# EAGLE design USBBoost (EAGLE 6.3)
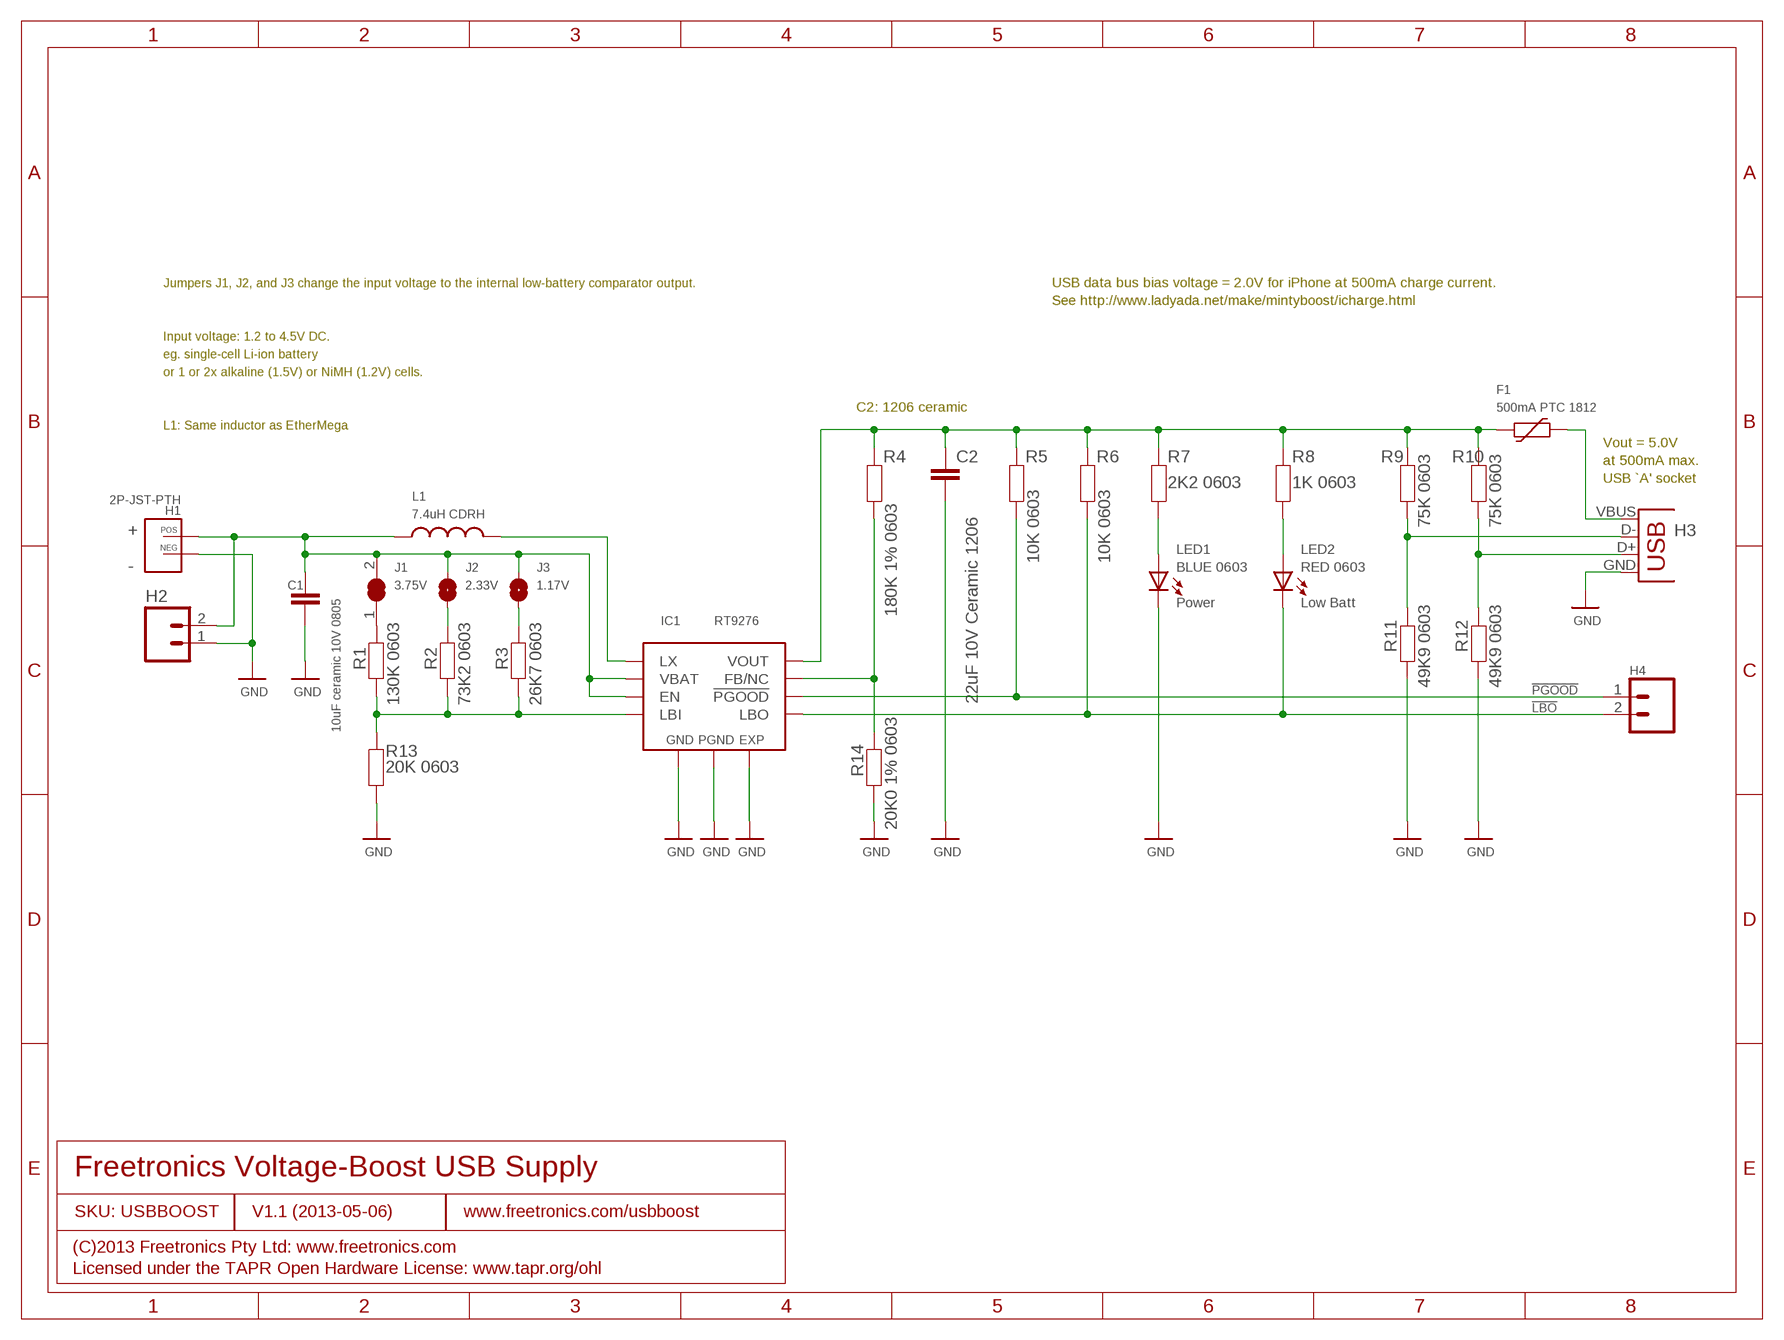
[diagram p0: schematic, sheet 1]

## Parts
C1  10uF ceramic 10V 0805  C-EUC0805  [C0805]
C2  22uF 10V Ceramic 1206  C-EUC1206K  [C1206K]
F1  500mA PTC 1812  PTC  [1812]
H1  2P-JST-PTH  2P-JST-TH-RAPTH  [JST-2MM-TH-RA]
H2  M02PTH  [1X02]
H3  USB  USB_  [USB-A-S-SILK-FEMALE]
H4  Status  M02PTH  [1X02]
IC1  RT9276  [WDFN-10L-3X3]
J1  3.75V  SJCN  [SJC]
J2  2.33V  SJ  [SJ]
J3  1.17V  SJ  [SJ]
L1  7.4uH CDRH  INDUCTOR  [CDRH]
LED1  BLUE 0603  LED0603  [LED-0603]
LED2  RED 0603  LED0603  [LED-0603]
R1  130K 0603  RESISTOR0603  [0603]
R2  73K2 0603  RESISTOR0603  [0603]
R3  26K7 0603  RESISTOR0603  [0603]
R4  180K 1% 0603  RESISTOR0603  [0603]
R5  10K 0603  RESISTOR0603  [0603]
R6  10K 0603  RESISTOR0603  [0603]
R7  2K2 0603  RESISTOR0603  [0603]
R8  1K 0603  RESISTOR0603  [0603]
R9  75K 0603  RESISTOR0603  [0603]
R10  75K 0603  RESISTOR0603  [0603]
R11  49K9 0603  RESISTOR0603  [0603]
R12  49K9 0603  RESISTOR0603  [0603]
R13  20K 0603  RESISTOR0603  [0603]
R14  20K0 1% 0603  RESISTOR0603  [0603]

## Nets
!LBO: H4.2 IC1.4(LBO) LED2.C R6.2
!PGOOD: H4.1 IC1.8(!PGOOD) R5.2
FB: IC1.3(FB/NC) R4.2 R14.2
GND: C1.2 C2.2 H1.NEG H2.1 H3.GND IC1.5(GND) IC1.10(PGND) IC1.EXP LED1.C R11.2 R12.2 R13.1 R14.1
LBI: IC1.7(LBI) R1.1 R2.1 R3.1 R13.2
LX: IC1.9(LX) L1.2
N$5: J1.1 R1.2
N$7: H3.D- R9.2 R11.1
N$8: LED1.A R7.2
N$9: F1.2 H3.VBUS
N$10: H3.D+ R10.2 R12.1
N$11: J2.1 R2.2
N$12: J3.1 R3.2
N$15: LED2.A R8.2
VBAT: C1.1 H1.POS H2.2 IC1.1(EN) IC1.6(VBAT) J1.2 J2.2 J3.2 L1.1
VOUT: C2.1 F1.1 IC1.2(VOUT) R4.1 R5.1 R6.1 R7.1 R8.1 R9.1 R10.1

## Notes on the sheet
- Jumpers J1, J2, and J3 change the input voltage to the internal low-battery comparator output. | USB data bus bias voltage = 2.0V for iPhone at 500mA charge current.
- See http://www.ladyada.net/make/mintyboost/icharge.html
- Input voltage: 1.2 to 4.5V DC.
- eg. single-cell Li-ion battery
- or 1 or 2x alkaline (1.5V) or NiMH (1.2V) cells.
- C2: 1206 ceramic
- L1: Same inductor as EtherMega
- Vout = 5.0V
- at 500mA max.
- USB `A' socket
- + | H3
- -
- Power | Low Batt
- Freetronics Voltage-Boost USB Supply
- SKU: USBBOOST | V1.1 (2013-05-06) | www.freetronics.com/usbboost
- (C)2013 Freetronics Pty Ltd: www.freetronics.com
- Licensed under the TAPR Open Hardware License: www.tapr.org/ohl

## Library data of the parts
C1 C2 = freetronics-jon:C-EU: CAPACITOR, European symbol
F1 = freetronics-luke:PTC: Polymeric PTC ("Polyfuse")
H1 = freetronics-jon:2P-JST-TH-RA: 2.0 mm pitch, through-hole 2-pin right-angle JST header, suitable for small Li-po batteries.
H2 = freetronics-master-v1.1:M02: Header 2 Standard 2-pin 0.1" header. Use with straight break away headers (SKU : PRT-00116), right angle break away headers (PRT-00553), swiss pins (PRT-00743), machine pins (PRT-00117), and female headers (PRT-00115). Molex polarized connector foot print use with SKU : PRT-08233 with associated crimp pins and housings.
H3 = freetronics-master-v1:USB: USB Connectors USB-B-PTH is fully proven SKU : PRT-00139 USB-miniB is fully proven SKU : PRT-00587 USB-A-PCB is untested. USB-A-H is throughly reviewed, but untested. Spark Fun Electronics SKU : PRT-00437 USB-B-SMT is throughly reviewed, but untested. Needs silkscreen touching up. USB-A-S has not been used/tested USB-MB-H has not been used/tested
H4 = freetronics-master-v1:M02: Header 2 Standard 2-pin 0.1" header. Use with straight break away headers (SKU : PRT-00116), right angle break away headers (PRT-00553), swiss pins (PRT-00743), machine pins (PRT-00117), and female headers (PRT-00115). Molex polarized connector foot print use with SKU : PRT-08233 with associated crimp pins and housings.
IC1 = freetronics-luke:RT9276: Richtek RT9276 boost converter. www.richtek.com/download_ds.jsp?s=631
J1 = freetronics-jon:SJC
J2 J3 = freetronics-luke:SJ: PCB "solder jumper". Note that there should nothing on the BOM corresponding to this "component".
L1 = freetronics-luke:INDUCTOR
LED1 LED2 = freetronics-master-v1:LED: LEDs Standard schematic elements and footprints for 5mm, 3mm, 1206, and 0603 sized LEDs. 5mm - Spark Fun Electronics SKU : COM-00529 (and others)
R1 = freetronics-master-v1.1:RESISTOR: Resistor Basic schematic elements and footprints for 0603, 1206, and PTH 1/10th watt (small) resistors.
R2-R14 = freetronics-original:RESISTOR: Resistor Basic schematic elements and footprints for 0603, 1206, and PTH 1/10th watt (small) resistors.

## Net classes
0 default: width 0.152 mm, drill 0.241 mm, clearance 0.152 mm

## Board
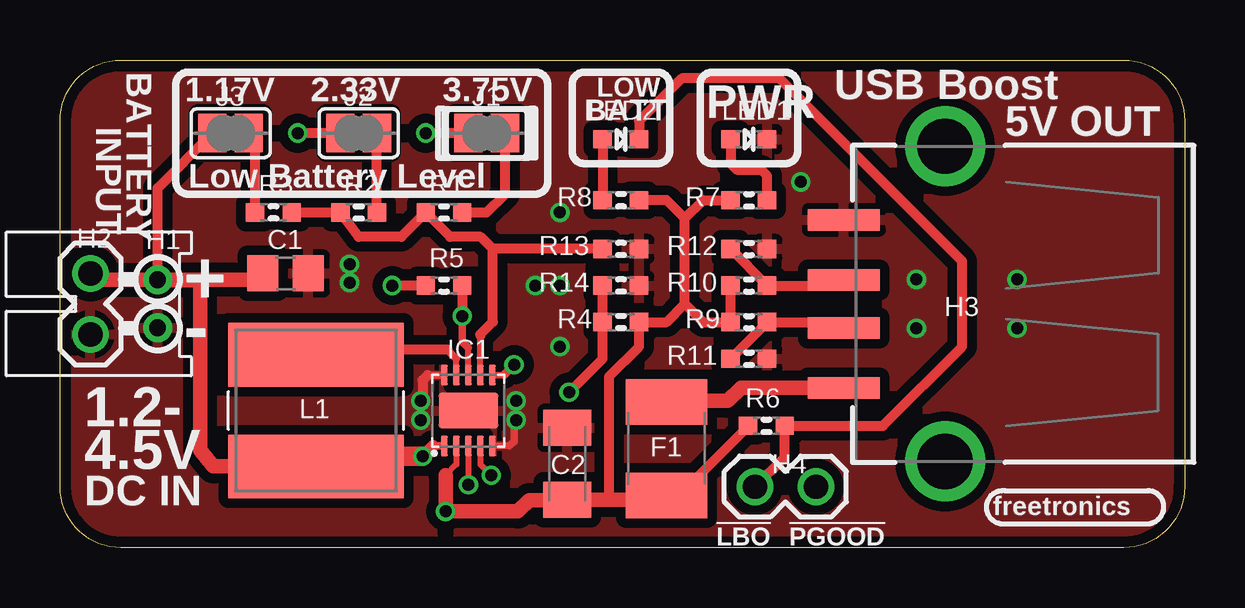
[diagram p1: board, top side]
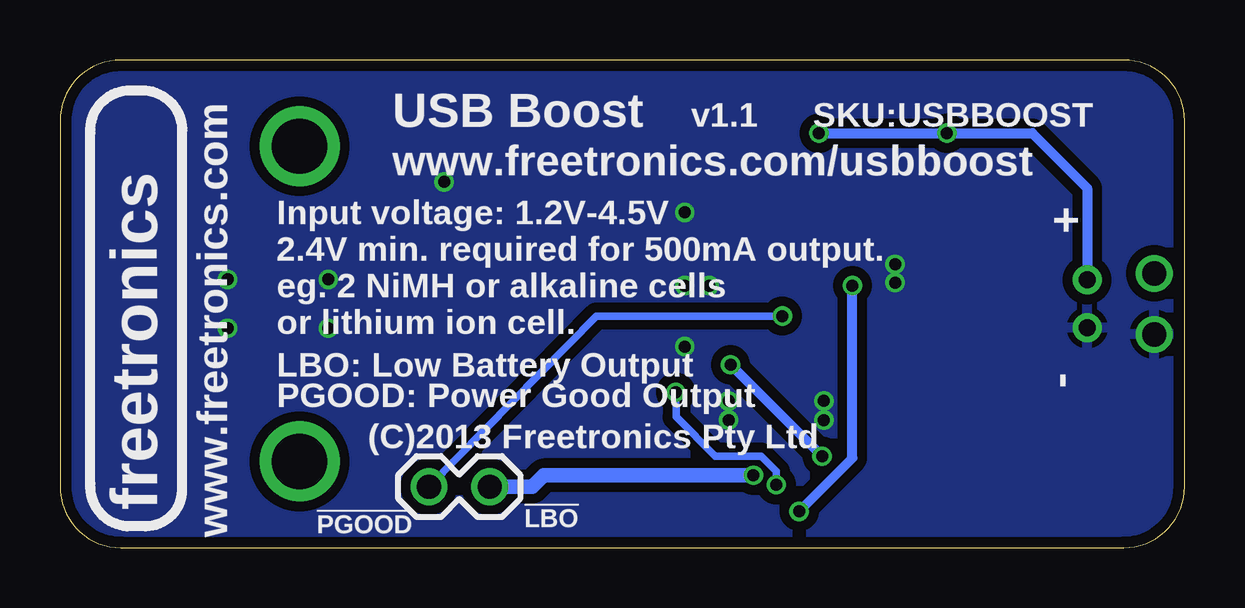
[diagram p2: board, bottom side, seen from below]

Size 46.86 x 20.32 mm. Coordinates in mm from the lower left corner, seen from the top.
Outline: 0,17.78 arc-90 2.54,20.32 44.32,20.32 arc-90 46.86,17.78 46.86,2.54 arc-90 44.32,0 2.54,0 arc-90 0,2.54 0,17.78
Copper layers (1*16): Top 0.035mm / dielectric 1.5mm / Bottom 0.035mm
Design rules "default": minimum track width 8mil, minimum drill 15mil, track to track 8mil, track to pad 8mil, pad to pad 8mil, via to via 8mil, smd to smd 8mil, copper to edge 18mil, drill to drill 8mil, minimum pad ring 10mil, minimum via ring 6mil, stop-mask expansion 4mil, vias tented up to drill 25mil, thermal gap 10mil

### Footprints (pad centres in the part's own frame; a part is rotated, then mirrored left to right if it is on the bottom)
C0805 = smd 1.3 x 1.5: 1 -0.95,0; 2 0.95,0
C1206K = smd 1.5 x 2: 1 -1.5,0; 2 1.5,0
1812 = smd 1.9 x 3.4: 1 -1.95,0; 2 1.95,0
JST-2MM-TH-RA = drill 0.7: NEG -1,-3.81; POS 1,-3.81
1X02 = drill 1.016: 1 0,0; 2 2.54,0
USB-A-S-SILK-FEMALE = smd 3 x 0.9: D+ 7.212,-1; D- 7.212,1; GND 7.212,-3.5; VBUS 7.212,3.5 | drill 2.311: SHELL1 3,6.566; SHELL2 3,-6.566
WDFN-10L-3X3 = smd 0.85 x 0.3: 1 -1.475,1; 2 -1.475,0.5; 3 -1.475,0; 4 -1.475,-0.5; 5 -1.475,-1; 6 1.475,-1; 7 1.475,-0.5; 8 1.475,0; 9 1.475,0.5; 10 1.475,1 | smd 1.5 x 2.5: EXP 0,0
SJC = smd 1.168 x 1.6: 1 -0.762,0; 2 0.762,0
SJ = smd 1.168 x 1.6: 1 -0.762,0; 2 0.762,0
CDRH = smd 7.3 x 2.65: 1 0,2.325; 2 0,-2.325
LED-0603 = smd 0.762 x 0.762: A -0.762,0; C 0.762,0
0603 = smd 0.762 x 0.762: 1 -0.762,0; 2 0.762,0

### Placement (x,y rotation side)
C1  9.4,11.43 0 top
C2  21.15,3.49 90 top
F1  25.27,4.13 90 top
H1  0.25,10.16 90 top
H2  1.27,8.89 90 top
H3  39.88,10.16 180 top
H4  31.5,2.54 180 top
IC1  17.02,5.71 90 top
J1  17.78,17.27 180 top
J2  12.45,17.27 180 top
J3  7.11,17.27 180 top
L1  10.67,5.71 180 top
LED1  28.7,17.02 0 top
LED2  23.37,17.02 0 top
R1  16,13.97 0 top
R2  12.45,13.97 0 top
R3  8.89,13.97 180 top
R4  23.37,9.4 180 top
R5  16,10.92 0 top
R6  29.43,5.08 0 top
R7  28.7,14.48 0 top
R8  23.37,14.48 180 top
R9  28.7,9.4 0 top
R10  28.7,10.92 0 top
R11  28.7,7.87 0 top
R12  28.7,12.45 0 top
R13  23.37,12.45 180 top
R14  23.37,10.92 180 top

### Tracks (layer width: path | path; a pad name or v marks a point on that pad's centre or on a via)
!LBO  (via drill 0.5)
  Top 0.254: IC1.4 17.52,3.47 v17.97,3.02
  Top 0.406: LED2.C 24.13,17.78 25.91,19.56 29.97,19.56 37.59,11.94 37.59,8.38 34.29,5.08 R6.2 30.19,3.78 H4.2
  Bottom 0.61: v17.97,3.02 26.7,3.02 27.18,2.54 H4.2
!PGOOD  (via drill 0.5)
  Top 0.254: IC1.8 17.02,8.33
  Top 0.305: 17.02,8.33 16.76,8.59 v16.76,9.65
  Top 0.406: R5.2 v16.76,9.65
  Bottom 0.305: H4.1 24.51,9.65 v16.76,9.65
FB  (via drill 0.5)
  Top 0.254: IC1.3 v17.02,2.62
  Top 0.406: R14.2 R4.2 22.61,7.87 v21.21,6.48
  Bottom 0.305: v17.02,2.62 17.02,3.17 17.65,3.81 19.56,3.81 21.19,5.45 v21.21,6.48
GND  (via drill 0.5)
  Top 0.279: IC1.5 18.72,4.24
  Top 0.305: IC1.10 15.32,7.19 | 18.72,4.24 18.92,4.45 18.92,5.24 v19,5.32
  Top 0.406: 15.32,7.19 15.11,6.99 15.11,6.19 v15.03,6.11
  other vias: 19,6.11 15.03,5.32 20.83,10.92 30.86,15.24 35.69,11.18 35.69,9.14 39.88,11.18 12.06,11.81 12.06,11.05 20.83,13.97 19.81,10.92 20.83,8.38 39.88,9.14
  pour Top (isolate 0.406): 0,17.78 arc-90 2.54,20.32 44.32,20.32 arc-90 46.86,17.78 46.86,2.54 arc-90 44.32,0 2.54,0 arc-90 0,2.54
  pour Bottom (isolate 0.406): 0,17.78 arc-90 2.54,20.32 44.32,20.32 arc-90 46.86,17.78 46.86,2.54 arc-90 44.32,0 2.54,0 arc-90 0,2.54
LBI
  Top 0.254: IC1.7 17.52,8.85
  Top 0.406: R3.1 R2.1 12.45,12.95 14.22,12.95 R1.1 16.26,12.95 17.53,12.95 18.03,12.45 | 18.03,12.45 18.03,9.41 17.52,8.9 17.52,8.85 | R13.2 18.03,12.45
LX
  Top 0.254: IC1.9 16.52,7.88 | 13.21,8.26 13.13,8.18
  Top 0.305: 16.52,7.88 16.14,8.26
  Top 0.406: 16.14,8.26 13.21,8.26 | 13.13,8.18 10.11,8.18 10.03,8.26 10.45,8.26 L1.2
N$5
  Top 0.406: R1.2 17.78,13.97 18.54,14.73 J1.1
N$7
  Top 0.406: 32.55,9.27 H3.D- 32.43,9.4 R9.2 R11.1
N$8
  Top 0.406: R7.2 29.46,15.49 29.21,15.75 28.19,15.75 27.94,16 LED1.A
N$9
  Top 0.61: 31.62,6.66 28.38,6.66 27.83,6.11 25.31,6.11 F1.2
  Top 0.813: H3.VBUS 31.62,6.66 | 25.32,6.03 F1.2
N$10
  Top 0.406: H3.D+ 32.43,10.92 R10.2 R12.1
N$11
  Top 0.406: R2.2 J2.1
N$12
  Top 0.406: R3.2 8.13,17.02 J3.1
N$15
  Top 0.406: LED2.A R8.2
VBAT  (via drill 0.5)
  Top 0.279: IC1.6 18.49,7.19
  Top 0.305: IC1.1 15.54,4.24
  Top 0.33: 18.49,7.19 v18.92,7.62
  Top 0.406: 13.21,3.81 11.09,3.81 L1.1 | J3.2 4.06,14.99 H1.POS | J1.2 v15.24,17.27 | J2.2 v9.91,17.27 | 8.16,11.43 7.89,11.16 | 5.84,11.05 4.57,11.05 4.57,11.16
  Top 0.508: 15.54,4.24 v15.11,3.81
  Top 0.61: 8.16,11.43 C1.1 | L1.1 6.39,3.39 5.84,4.06 5.84,11.05 | 7.89,11.16 4.57,11.16 H1.POS 1.54,11.16 H2.2
  Top 0.813: v15.11,3.81 13.21,3.81
  Bottom 0.406: v18.92,7.62 v15.11,3.81 | v15.24,17.27 v9.91,17.27 J3.2 4.06,14.99 H1.POS
VOUT  (via drill 0.5)
  Top 0.254: IC1.2 16.52,3.47 16.07,3.02
  Top 0.305: C2.1 21.39,1.99
  Top 0.406: R10.1 R9.1 26.8,9.4 26.04,10.16 | R5.1 v13.84,10.92 | 26.42,2.79 25.89,2.79 F1.1 25.8,2.18 28.7,5.08 R6.1 | 22.86,1.99 22.89,2.02 22.89,7.14 24.13,8.38 R4.1 25.27,9.4 26.04,10.16 | 26.04,10.16 26.04,13.72 | 26.04,13.72 26.8,14.48 R7.1 | 26.04,13.72 25.27,14.48 R8.1
  Top 0.61: 16.07,3.02 v16.07,1.51 19.08,1.51 19.56,1.98 21.14,1.98 C2.1 22.86,1.99 25.09,1.99 F1.1
  Bottom 0.406: v13.84,10.92 13.84,3.73 v16.07,1.51

### Text on the board
tPlace: BATTERY | 1.17V | 2.33V | 3.75V | LOW | USB Boost | INPUT | BATT | PWR | 5V OUT | Low Battery Level | + | - | 1.2- | 4.5V | DC IN | freetronics | !LBO | !PGOOD
bPlace: SKU:USBBOOST | v1.1 | USB Boost | www.freetronics.com/usbboost | + | Input voltage: 1.2V-4.5V | 2.4V min. required for 500mA output. | eg. 2 NiMH or alkaline cells | or lithium ion cell. | - | LBO: Low Battery Output | PGOOD: Power Good Output | (C)2013 Freetronics Pty Ltd | freetronics | !LBO | !PGOOD | www.freetronics.com
tDocu: A | K | A | K